# Altium project ESP32 USB DONGLE.PrjPcb
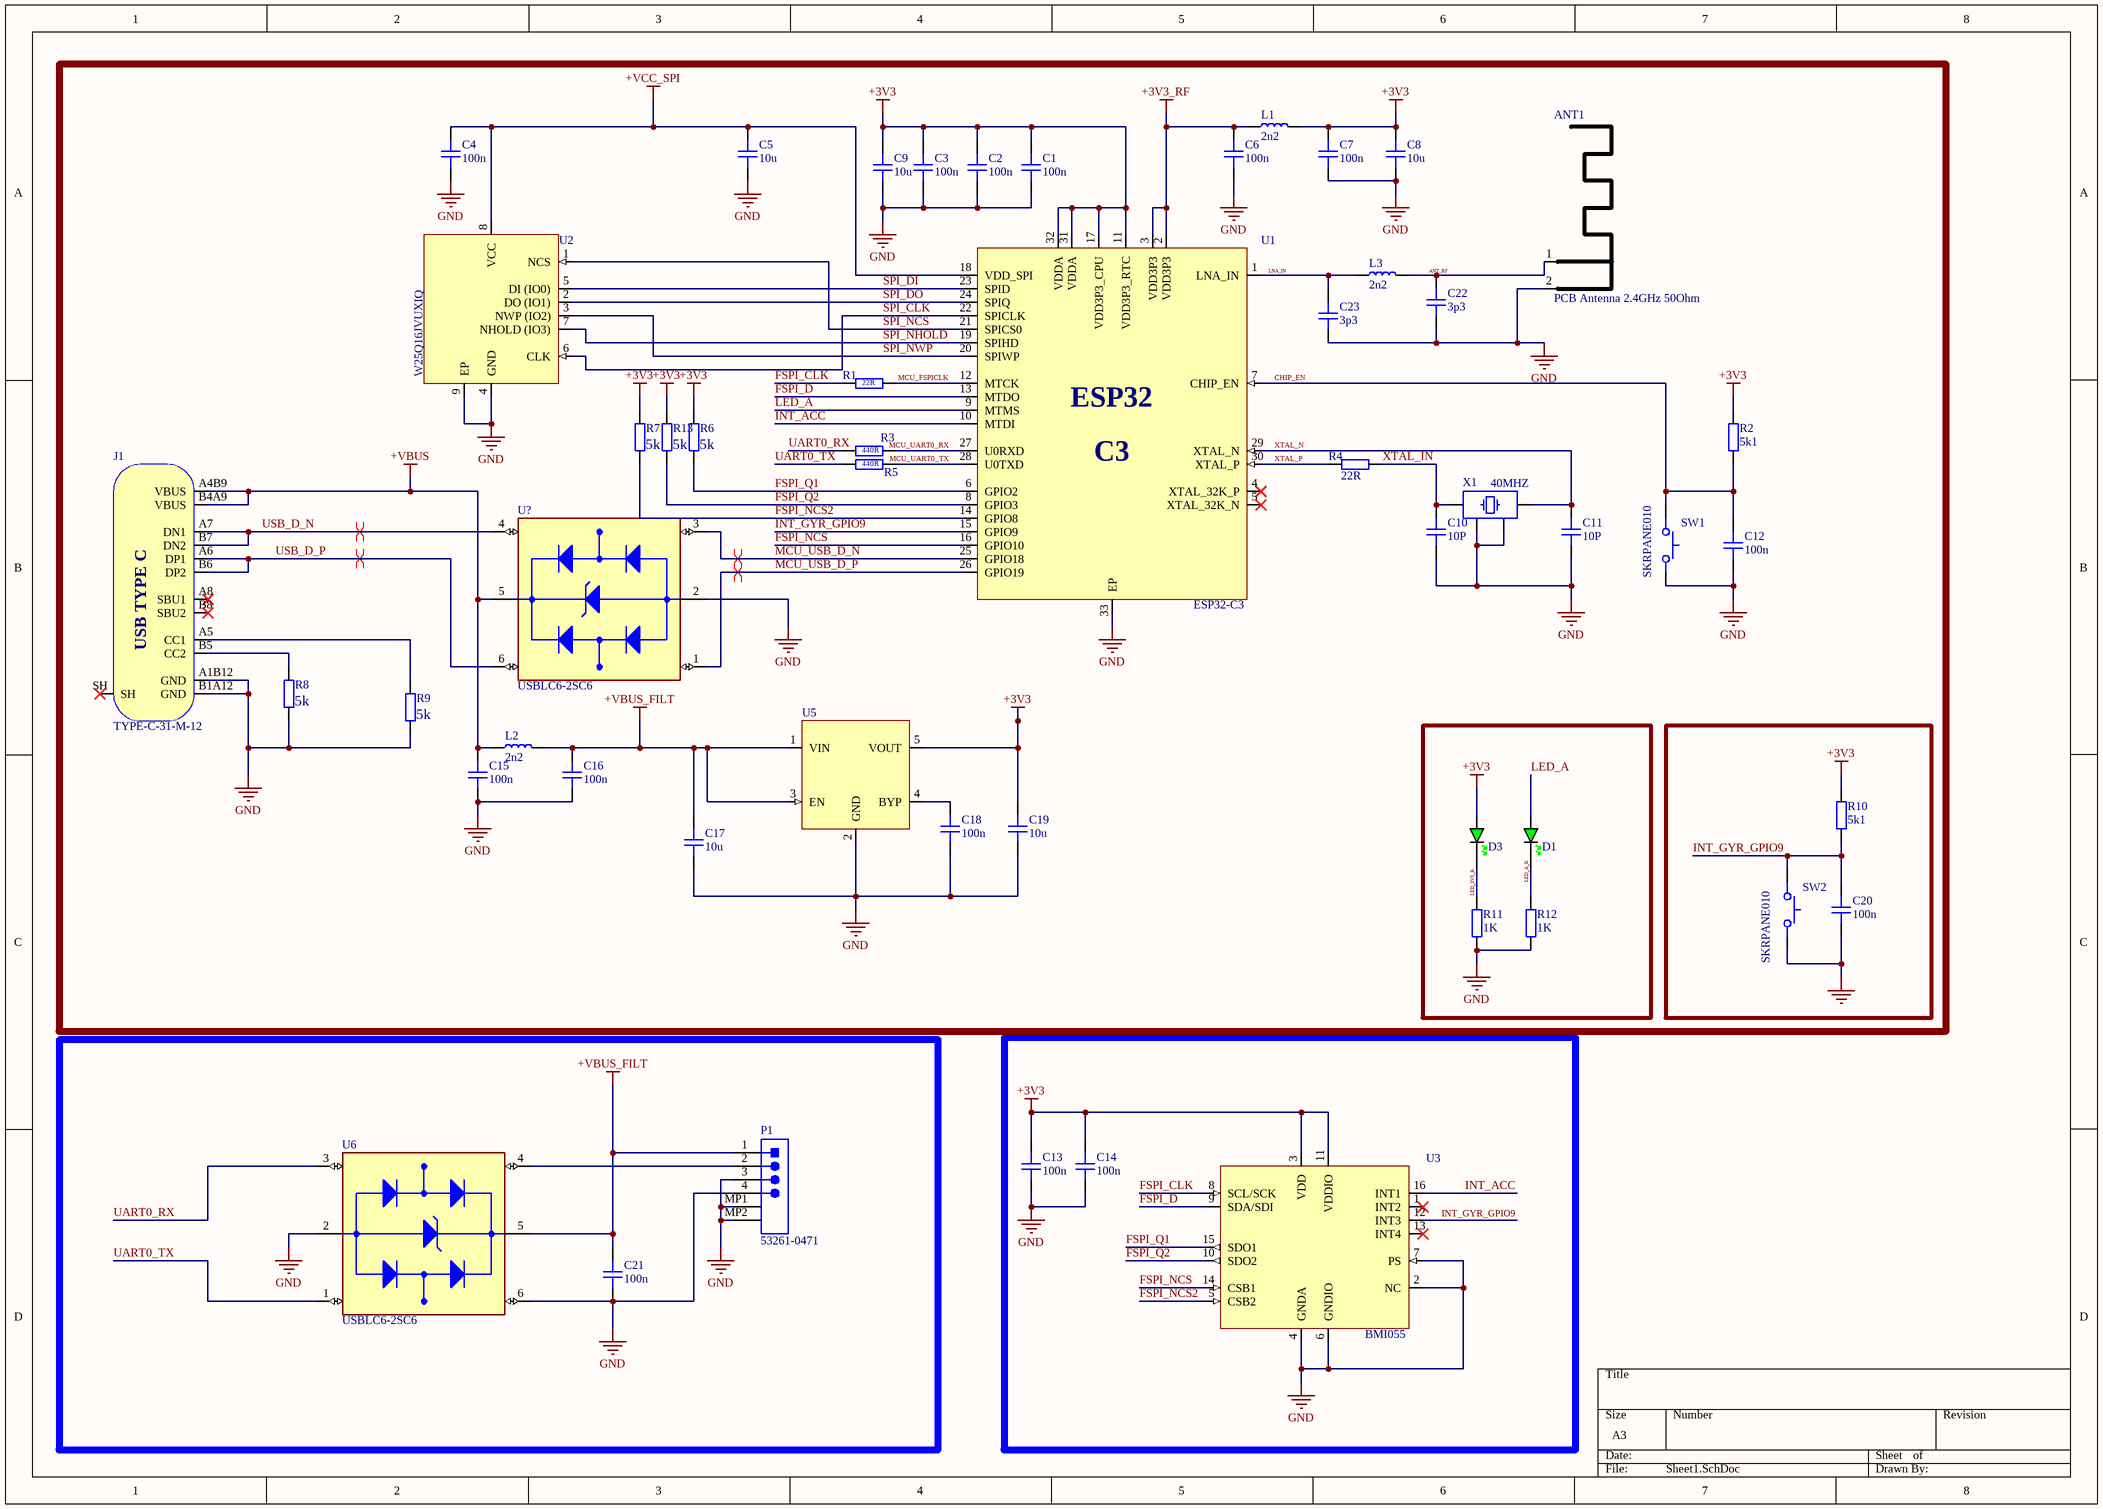
[diagram p0: Sheet1.SchDoc]
1 sheet, 53 parts. Net scope: global (net labels, ports and power ports of the same name join across sheets).
Board file: PCB1.PcbDoc

## Sheet Sheet1.SchDoc
size A3; SheetNumber: 1; SheetTotal: 1

### Parts
ANT1  PCB Antenna 2.4GHz 50Ohm  [ANT_IFA_USB_2_4GHZ_50R]  (no BOM)
C1  100n  [CAP_0402]
C2  100n  [CAP_0402]
C3  100n  [CAP_0402]
C4  100n  [CAP_0402]
C5  10u  [CAP_0603]
C6  100n  [CAP_0402]
C7  100n  [CAP_0402]
C8  10u  [CAP_0603]
C9  10u  [CAP_0603]
C10  10P  [CAP_0402]
C11  10P  [CAP_0402]
C12  100n  [CAP_0402]
C13  100n  [CAP_0402]
C14  100n  [CAP_0402]
C15  100n  [CAP_0402]
C16  100n  [CAP_0402]
C17  10u  [CAP_0603]
C18  100n  [CAP_0402]
C19  10u  [CAP_0603]
C20  100n  [CAP_0402]
C21  100n  [CAP_0402]
C22  3p3  [CAP_0402]
C23  3p3  [CAP_0402]
D1  GREEN  [LED_0603_GREEN]  (value not drawn)
D3  GREEN  [LED_0603_GREEN]  (value not drawn)
J1  TYPE-C-31-M-12  [TYPE-C-31-M-12]
L1  2n2  [IND_0402]
L2  2n2  [IND_0402]
L3  2n2  [IND_0402]
P1  53261-0471  [MOLEX-53261-0471_V]
R1  22R  [RES_0402]
R2  5k1  [RES_0402]
R3  440R  [RES_0402]
R4  22R  [RES_0402]
R5  440R  [RES_0402]
R6  5k  [RES_0402]
R7  5k  [RES_0402]
R8  5k  [RES_0402]
R9  5k  [RES_0402]
R10  5k1  [RES_0402]
R11  1K  [RES_0402]
R12  1K  [RES_0402]
R13  5k  [RES_0402]
SW1  SKRPANE010  [SKRPANE010]
SW2  SKRPANE010  [SKRPANE010]
U1  ESP32-C3  [QFN32-5x5]
U2  W25Q16JVUXIQ  [USON-8-2X3MM]
U3  BMI055  [BMI088]
U5  SPX3819M5-L-3-3/TR  [SOT-23-5]  (value not drawn)
U6  USBLC6-2SC6  [SOT95P280X145-6N]
U?  USBLC6-2SC6  [SOT95P280X145-6N]
X1  40MHZ  [XTAL_2520]

### Nets
+3V3: C1.2 C2.2 C3.2 C7.2 C8.2 C9.2 C13.2 C14.2 C19.2 D3.A L1.2 R2.2 R6.2 R7.2 R10.2 R13.2 U1.11(VDD3P3_RTC) U1.17(VDD3P3_CPU) U1.31(VDDA) U1.32(VDDA) U3.3(VDD) U3.11(VDDIO) U5.5(VOUT)
+3V3_RF: C6.2 L1.1 U1.2(VDD3P3) U1.3(VDD3P3)
+VBUS: C15.2 J1.A4B9(VBUS) J1.B4A9(VBUS) L2.1 U?.5(VBUS)
+VBUS_FILT: C16.2 C17.2 C21.1 L2.2 P1.1 U5.1(VIN) U5.3(EN) U6.5(VBUS)
+VCC_SPI: C4.2 C5.2 U1.18(VDD_SPI) U2.8(VCC)
GND: ANT1.2(GND) C1.1 C2.1 C3.1 C4.1 C5.1 C6.1 C7.1 C8.1 C9.1 C10.1 C11.1 C12.1 C13.1 C14.1 C15.1 C16.1 C17.1 C18.1 C19.1 C20.1 C21.2 C22.1 C23.1 J1.A1B12(GND) J1.B1A12(GND) P1.3 P1.4 P1.MP1 P1.MP2 R8.1 R9.1 R11.1 R12.1 SW1.12 SW2.12 U1.33(EP) U2.4(GND) U2.9(EP) U3.2(NC) U3.4(GNDA) U3.6(GNDIO) U3.7(PS) U5.2(GND) U6.2(GND) U6.6(I/O1_OUT) U?.2(GND) X1.2 X1.4
ANT_RF: ANT1.1(RF) C22.2 L3.1
CHIP_EN: C12.2 R2.1 SW1.34 U1.7(CHIP_EN)
FSPI_CLK: R1.1 U3.8(SCL/SCK)
FSPI_D: U1.13(MTDO) U3.9(SDA/SDI)
FSPI_NCS: U1.16(GPIO10) U3.14(CSB1)
FSPI_NCS2: R7.1 U1.14(GPIO8) U3.5(CSB2)
FSPI_Q1: R6.1 U1.6(GPIO2) U3.15(SDO1)
FSPI_Q2: R13.1 U1.8(GPIO3) U3.10(SDO2)
INT_ACC: U1.10(MTDI) U3.16(INT1)
INT_GYR_GPIO9: C20.2 R10.1 SW2.34 U1.15(GPIO9) U3.12(INT3)
LED_3V3_K: D3.K R11.2
LED_A: D1.A U1.9(MTMS)
LED_A_K: D1.K R12.2
LNA_IN: C23.2 L3.2 U1.1(LNA_IN)
MCU_FSPICLK: R1.2 U1.12(MTCK)
MCU_UART0_RX: R3.2 U1.27(U0RXD)
MCU_UART0_TX: R5.2 U1.28(U0TXD)
MCU_USB_D_N: U1.25(GPIO18) U?.3(I/O2_IN)
MCU_USB_D_P: U1.26(GPIO19) U?.1(I/O1_IN)
SPI_CLK: U1.22(SPICLK) U2.6(CLK)
SPI_DI: U1.23(SPID) U2.5(DI_(IO0))
SPI_DO: U1.24(SPIQ) U2.2(DO_(IO1))
SPI_NCS: U1.21(SPICS0) U2.1(NCS)
SPI_NHOLD: U1.19(SPIHD) U2.7(NHOLD_(IO3))
SPI_NWP: U1.20(SPIWP) U2.3(NWP_(IO2))
UART0_RX: R3.1 U6.3(I/O2_IN)
UART0_TX: R5.1 U6.1(I/O1_IN)
USB_D_N: J1.A7(DN1) J1.B7(DN2) U?.4(I/O2_OUT)
USB_D_P: J1.A6(DP1) J1.B6(DP2) U?.6(I/O1_OUT)
XTAL_IN: C10.2 R4.2 X1.1
XTAL_N: C11.2 U1.29(XTAL_N) X1.3
XTAL_P: R4.1 U1.30(XTAL_P)
NetC18_2: C18.2 U5.4(BYP)
NetJ1_A5: J1.A5(CC1) R9.2
NetJ1_B5: J1.B5(CC2) R8.2
NetP1_2: P1.2 U6.4(I/O2_OUT)

Not connected (* = marked no-connect by the designer): J1 A8(SBU1)* B8(SBU2)* SH*; U1 4(XTAL_32K_P)* 5(XTAL_32K_N)*; U3 1(INT2)* 13(INT4)*

### Layout directives
differential pair; differential pair class DIFF_USB: MCU_USB_D_N, MCU_USB_D_P
differential pair; differential pair class DIFF_USB_2: USB_D_N, USB_D_P

### Notes on the sheet
- (in symbol ESP32-C3) ESP32; C3
- (in symbol TYPE-C-31-M-12) USB TYPE C

### Library data of the parts
ANT1 = ANT_IFA_USB_2_4GHZ_50R: Inverted F 2.4GHz ISM PCB Antenna 50 Ohm; ComponentLink1Description: Datasheet; ComponentLink1URL: https://www.ti.com/lit/an/swra117d/swra117d.pdf
C1-C4 C6 C7 C10-C16 C18 = CAP_0402: Capacitor SMD 0402; Manufacturer: *; Manufacturer Part Number: *; Distributor Link: *; LCSC: *; Rating: *; Dielectric: *
C5 C8 C9 = CAP_0603: Capacitor SMD 0603; Manufacturer: *; Manufacturer Part Number: *; Distributor Link: *; LCSC: *; Rating: *; Dielectric: *
C17 C19 = CAP_0603_10V: Capacitor SMD 0603 10V; Manufacturer: Samsung; Manufacturer Part Number: CL10A106KP8NNNC; LCSC: C19702
C20 C21 = CAP_0402_50V: Capacitor SMD 0402 50V; Manufacturer: Samsung; Manufacturer Part Number: CL05B104KO5NNNC; LCSC: C1525
C22 C23 = CAP_0402_50V: Capacitor SMD 0402 50V; Manufacturer: FH; Manufacturer Part Number: 0402CG3R3C500NT; LCSC: C1565
D1 D3 = LED_0603_GREEN: LED 0603 GREEN SMD; LCSC: C72043
J1 = TYPE-C-31-M-12: USB Type C Connector Horizontal SMT; Manufacturer: Koren Hroparts; Manufacturer Part Number: TYPE-C-31-M-12
L1 L2 = IND_0402: Inductor SMD 0402
L3 = IND_0402: Inductor SMD 0402; Manufacturer: Murata; Manufacturer Part Number: LQW15AN2N2G80D; LCSC: C412264
P1 = CMP-2000-05238-1: Male Header, Pitch 1.25 mm, 1 x 4 Position, Height 3.4 mm, -40 to 85 degC, RoHS, Tape and Reel; Current Rating: 1A; Brand: Molex; Number of Positions / Contacts: 4; Pitch: 1.25mm; Voltage Rating: 125V; Mounting Angle: Right; Manufacturer URL: http://www.molex.com/; Factory Pack Quantity: 1000; Housing Material: Thermoplastic; Datasheet URL: http://www.molex.com/pdm_docs/sd/532610471_sd.pdf; Tradename: PicoBlade; Product Type: Headers; Contact Plating: Tin; Contact Material: PhosphorBronze; Package Description: 1.25mm Pitch PicoBlade(TM) Header, Surface Mount, Right Angle, Lead-Free, 4 Circuits; Mounting Style: SMD/SMT; Manufacturer: Molex; Series: 53261; Packaging: Reel; Number of Rows: 1; RoHS: Details; Number of Positions: 4; Product Category: Headers&WireHousings; Datasheet Version: Rev. G, 01/2012; Type: Shrouded; Termination Style: SMD
R1-R9 R11-R13 = RES_0402: Resistor SMD 0402; Manufacturer: *; Manufacturer Part Number: *; Distributor Link: *; LCSC: *
R10 = RES_0402: Resistor SMD 0402; Manufacturer: YAGEO; Manufacturer Part Number: RC0402JR-075K1L; LCSC: C105873
SW1 SW2 = SKRPANE010: Tactile Switch SMD SPST; Manufacturer: Alps Alpine; Manufacturer Part Number: SKRPANE010
  SW2: LCSC: C470426
U1 = ESP32-C3: Ultra­Low­Power SoC with RISC­V Single­Core CPU Supporting IEEE 802.11b/g/n (2.4 GHz Wi­Fi) and Bluetooth® 5 (LE); Manufacturer: Espressif; Manufacturer Part Number: ESP32-C3; LCSC: C2838500
U2 = W25Q16JVUXIQ: 16M-BIT SERIAL FLASH MEMORY WITH DUAL/QUAD SPI USON-8; Manufacturer: Winbond; Manufacturer Part Number: W25Q16JVUXIQ; LCSC: C2843335
U3 = BMI055: Inertial Measurement Unit IMU 6-Axis LGA; Manufacturer: Bosch; Manufacturer Part Number: BMI055; LCSC: C189620
U5 = SPX3819M5-L-3-3/TR: 500mA +3.3V Low-Noise LDO Voltage Regulator; Manufacturer: MaxLinear; Manufacturer Part Number: SPX3819M5-L-3-3/TR
U6 U? = USBLC6-2SC6: 17V Clamp 5A (8/20Âµs) Ipp Tvs Diode Surface Mount SOT-23-6; MF: STMicroelectronics; Value: *; SnapEDA_Link: https://www.snapeda.com/parts/USBLC6-2SC6/STMicroelectronics/view-part/?ref=snap; Check_prices: https://www.snapeda.com/parts/USBLC6-2SC6/STMicroelectronics/view-part/?ref=eda; Purchase-URL: https://pricing.snapeda.com/search/part/USBLC6-2SC6/?ref=eda; Price: None; Availability: In Stock; Package: SOT-23-6 STMicroelectronics; MP: USBLC6-2SC6
X1 = XTAL_2520: Crystal SMD 2520; Distributor Link: *